# Altium schematic sheet ATT-Open.SchDoc
size 420 x 297 mm; SheetNumber: 1; SheetTotal: 1
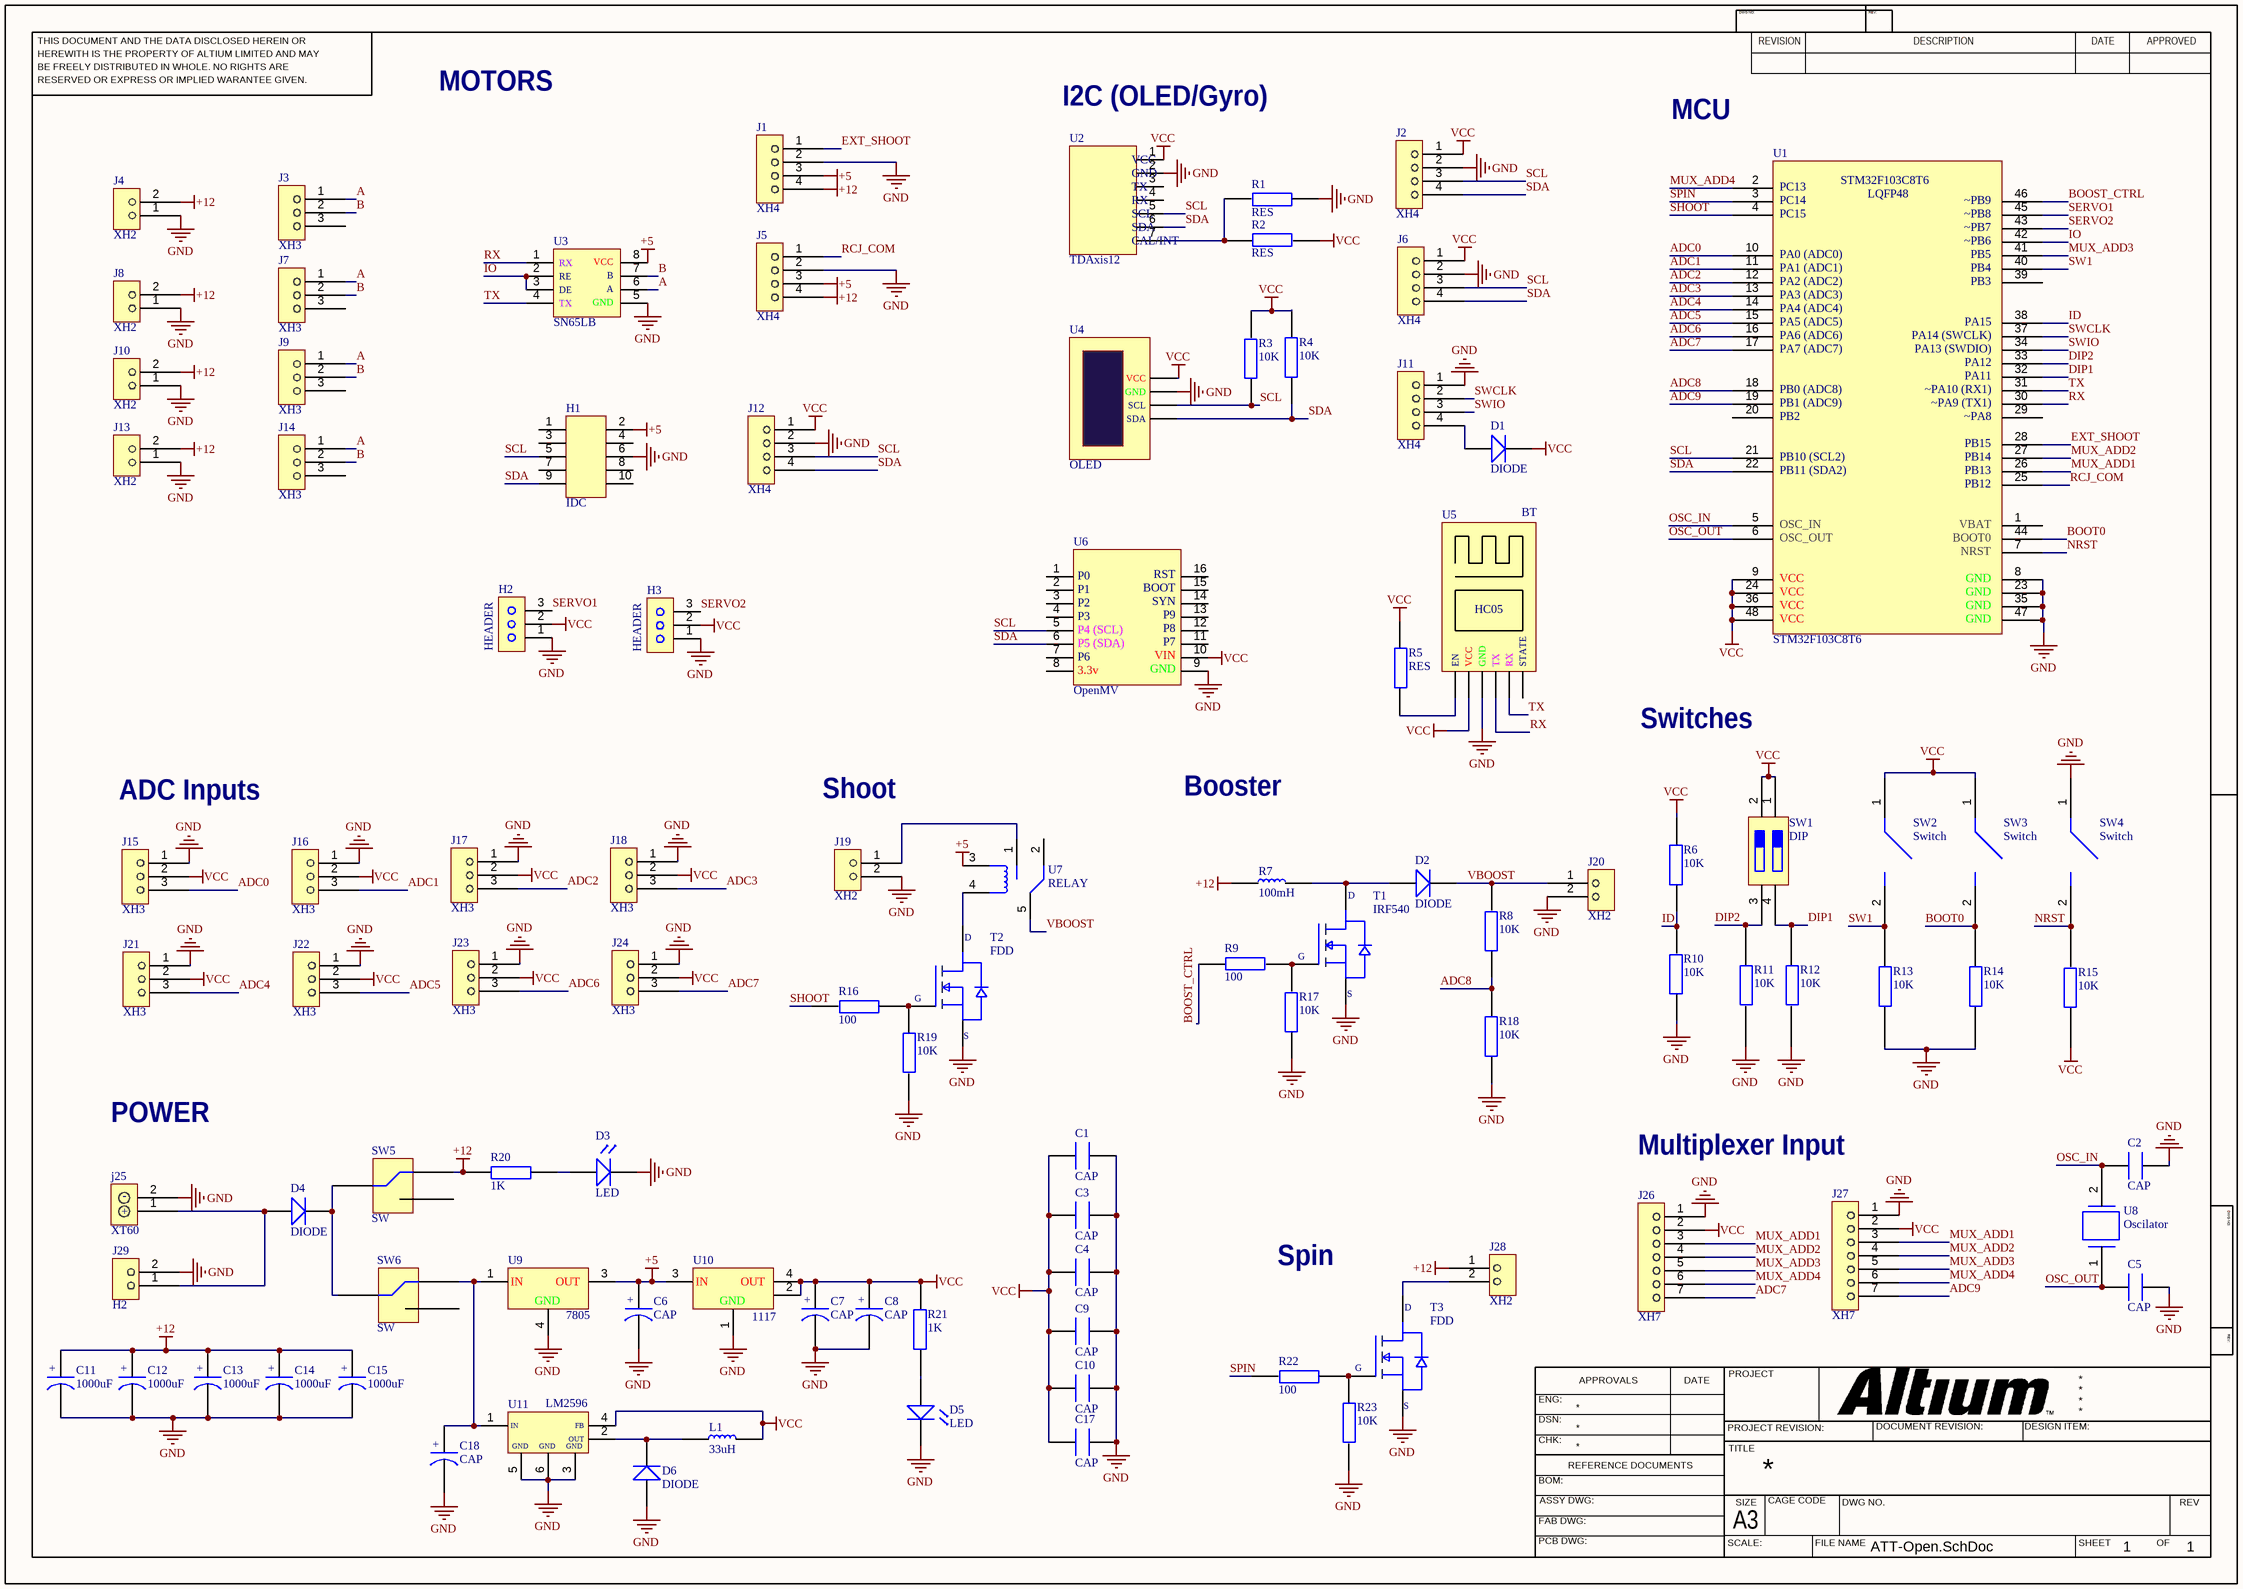
[diagram p0: ATT-Open.SchDoc]

## Parts
C1  CAP  [CAP1206]
C2  CAP  [CAP1206]
C3  CAP  [CAP1206]
C4  CAP  [CAP1206]
C5  CAP  [CAP1206]
C6  CAP  [CAP SMD 100uF 16V]
C7  CAP  [CAP SMD 100uF 16V]
C8  CAP  [CAP SMD 100uF 16V]
C9  CAP  [CAP1206]
C10  CAP  [CAP1206]
C11  1000uF  [CAP 5x10x13 black]
C12  1000uF  [CAP 5x10x13 black]
C13  1000uF  [CAP 5x10x13 black]
C14  1000uF  [CAP 5x10x13 black]
C15  1000uF  [CAP 5x10x13 black]
C17  CAP  [CAP1206]
C18  CAP  [CAP SMD 100uF 16V]
D1  DIODE  [Diode]
D2  DIODE  [Diode]
D3  LED  [LED GREEN 1206]
D4  DIODE  [Diode]
D5  LED  [LED GREEN 1206]
D6  DIODE  [Diode]
H1  IDC  [IDC 5x2]
H2  HEADER  [header 3 pin]
H3  HEADER  [header 3 pin]
J1  XH4  [XH 4PIN]
J2  XH4  [XH 4PIN]
J3  XH3  [XH 3PIN]
J4  XH2  [XH 2pin]
J5  XH4  [XH 4PIN]
J6  XH4  [XH 4PIN]
J7  XH3  [XH 3PIN]
J8  XH2  [XH 2pin]
J9  XH3  [XH 3PIN]
J10  XH2  [XH 2pin]
J11  XH4  [XH 4PIN]
J12  XH4  [XH 4PIN]
J13  XH2  [XH 2pin]
J14  XH3  [XH 3PIN]
J15  XH3  [XH 3PIN]
J16  XH3  [XH 3PIN]
J17  XH3  [XH 3PIN]
J18  XH3  [XH 3PIN]
J19  XH2  [XH 2pin]
J20  XH2  [XH 2pin]
J21  XH3  [XH 3PIN]
J22  XH3  [XH 3PIN]
J23  XH3  [XH 3PIN]
J24  XH3  [XH 3PIN]
j25  XT60  [XT60]
J26  XH7  [XH 7PIN]
J27  XH7  [XH 7PIN]
J28  XH2  [XH 2pin]
J29  H2  [H2 MOLEX]
L1  33uH  [Inductor 1206]
R1  RES  [RES1206]
R2  RES  [RES1206]
R3  10K  [RES1206]
R4  10K  [RES1206]
R5  RES  [RES1206]
R6  10K  [RES1206]
R7  100mH  [inductor]
R8  10K  [RES1206]
R9  100  [RES1206]
R10  10K  [RES1206]
R11  10K  [RES1206]
R12  10K  [RES1206]
R13  10K  [RES1206]
R14  10K  [RES1206]
R15  10K  [RES1206]
R16  100  [RES1206]
R17  10K  [RES1206]
R18  10K  [RES1206]
R19  10K  [RES1206]
R20  1K  [RES1206]
R21  1K  [RES1206]
R22  100  [RES1206]
R23  10K  [RES1206]
SW1  DIP  [DIP Switch 2]
SW2  Switch  [pushbutton]
SW3  Switch  [pushbutton]
SW4  Switch  [pushbutton]
SW5  SW  [SPDT Switch]
SW6  SW  [SPDT Switch]
T1  IRF540  [IRF540S]
T2  FDD  [FDD6690A]
T3  FDD  [FDD6690A]
U1  STM32F103C8T6  [STM32F103C8T6]
U2  TDAxis12  [TDAxis12]
U3  SN65LB  [SN65LB]
U4  OLED  [OLED SH1106]
U5  BT  [HC05]
U6  OpenMV  [OpenMV]
U7  RELAY  [Relay 5V 10A]
U8  Oscilator  [Crystal Oscilator]
U9  7805  [7805 (SOT-252)]
U10  1117  [AMS1117]
U11  LM2596  [LM2596]

## Nets
+5: C6.2 H1.2 J1.3 J5.3 U3.8 U7.3 U9.3 U10.3
+12: C11.2 C12.2 C13.2 C14.2 C15.2 J1.4 J4.2 J5.4 J8.2 J10.2 J13.2 J28.1 R7.1 R20.2 SW5.1
GND: C1.1 C2.2 C3.1 C4.1 C5.2 C6.1 C7.1 C8.1 C9.1 C10.1 C11.1 C12.1 C13.1 C14.1 C15.1 C17.1 C18.1 D3.2 D5.2 D6.1 H1.6 H2.1 H3.1 J1.2 J2.2 J4.1 J5.2 J6.2 J8.1 J10.1 J11.1 J12.2 J13.1 J15.1 J16.1 J17.1 J18.1 J19.2 J20.2 J21.1 J22.1 J23.1 J24.1 j25.2 J26.1 J27.1 J29.2 R1.1 R10.1 R11.2 R12.2 R13.2 R14.2 R17.1 R18.1 R19.2 R23.2 SW4.1 T1.3 T2.3 T3.3 U1.8 U1.23 U1.35 U1.47 U2.2 U3.5 U4.2 U5.3 U6.9 U9.4 U10.1 U11.3 U11.5 U11.6
VCC: C1.2 C3.2 C4.2 C7.2 C8.2 C9.2 C10.2 C17.2 D1.2 H2.2 H3.2 J2.1 J6.1 J12.1 J15.2 J16.2 J17.2 J18.2 J21.2 J22.2 J23.2 J24.2 J26.2 J27.2 L1.2 R2.2 R3.2 R4.2 R5.1 R6.2 R15.1 R21.2 SW1.1 SW1.2 SW2.1 SW3.1 U1.9 U1.24 U1.36 U1.48 U2.1 U4.1 U5.2 U6.10 U10.2 U10.4 U11.4
A: J3.1 J7.1 J9.1 J14.1 U3.6
ADC0: J15.3 U1.10
ADC1: J16.3 U1.11
ADC2: J17.3 U1.12
ADC3: J18.3 U1.13
ADC4: J21.3 U1.14
ADC5: J22.3 U1.15
ADC6: J23.3 U1.16
ADC7: J24.3 J26.7 U1.17
ADC8: R8.1 R18.2 U1.18
ADC9: J27.7 U1.19
B: J3.2 J7.2 J9.2 J14.2 U3.7
BOOST_CTRL: R9.1 U1.46
BOOT0: R14.1 SW3.2 U1.44
DIP1: R12.1 SW1.4 U1.32
DIP2: R11.1 SW1.3 U1.33
EXT_SHOOT: J1.1 U1.28
ID: R6.1 R10.2 U1.38
IO: U1.42 U3.2 U3.3
MUX_ADD1: J26.3 J27.3 U1.26
MUX_ADD2: J26.4 J27.4 U1.27
MUX_ADD3: J26.5 J27.5 U1.41
MUX_ADD4: J26.6 J27.6 U1.2
NRST: R15.2 SW4.2 U1.7
OSC_IN: C2.1 U1.5 U8.2
OSC_OUT: C5.1 U1.6 U8.1
RCJ_COM: J5.1 U1.25
RX: U1.30 U3.1 U5.4
SCL: H1.5 J2.3 J6.3 J12.3 R3.1 U1.21 U2.5 U4.3 U6.5
SDA: H1.9 J2.4 J6.4 J12.4 R4.1 U1.22 U2.6 U4.4 U6.6
SERVO1: H2.3 U1.45
SERVO2: H3.3 U1.43
SHOOT: R16.2 U1.4
SPIN: R22.2 U1.3
SW1: R13.1 SW2.2 U1.40
SWCLK: J11.2 U1.37
SWIO: J11.3 U1.34
TX: U1.31 U3.4 U5.5
VBOOST: D2.2 J20.1 R8.2 U7.5
NetC18_2: C18.2 SW6.1 U9.1 U11.1
NetD1_1: D1.1 J11.4
NetD2_1: D2.1 R7.2 T1.4
NetD3_1: D3.1 R20.1
NetD4_1: D4.1 j25.1 J29.1
NetD4_2: D4.2 SW5.2 SW6.2
NetD5_1: D5.1 R21.1
NetD6_2: D6.2 L1.1 U11.2
NetJ19_1: J19.1 U7.1
NetJ28_2: J28.2 T3.4
NetR1_2: R1.2 R2.1 U2.7
NetR5_2: R5.2 U5.1
NetR9_2: R9.2 R17.2 T1.1
NetR16_1: R16.1 R19.1 T2.1
NetR22_1: R22.1 R23.1 T3.1
NetT2_4: T2.4 U7.4

Not connected (* = marked no-connect by the designer): H1 1 3 4 7 8 10; J3 3; J7 3; J9 3; J14 3; SW5 3; SW6 3; U1 1 20 29 39; U2 3 4; U5 6; U6 1 2 3 4 7 8 11 12 13 14 15 16; U7 2

## Notes on the sheet
- MOTORS
- (near U2) I2C (OLED/Gyro)
- MCU
- Switches
- ADC Inputs
- Shoot
- Booster
- POWER
- Multiplexer Input
- Spin
- THIS DOCUMENT AND THE DATA DISCLOSED HEREIN OR
- HEREWITH IS THE PROPERTY OF ALTIUM LIMITED AND MAY
- DWG NO:
- REVISION
- REV:
- DESCRIPTION
- DATE
- APPROVED
- BE FREELY DISTRIBUTED IN WHOLE. NO RIGHTS ARE
- RESERVED OR EXPRESS OR IMPLIED WARANTEE GIVEN.
- ENG:
- APPROVALS
- PROJECT
- DSN:
- CHK:
- REFERENCE DOCUMENTS
- PROJECT REVISION:
- TITLE
- DOCUMENT REVISION:
- DESIGN ITEM:
- BOM:
- FAB DWG:
- PCB DWG:
- ASSY DWG:
- SCALE:
- A3
- SIZE
- CAGE CODE
- FILE NAME
- DWG NO.
- SHEET
- OF
- REV
- (in symbol 7805 (SOT-252)) IN; OUT; GND
- (in symbol AMS1117) IN; OUT; GND
- (in symbol CAP Electrolit SMD) +
- (in symbol Cap Electrolyte) +
- (in symbol FDD6690A) D; G; S
- (in symbol HC05) EN; VCC; GND; TX; RX; STATE
- (in symbol IRF540S) D; G; S
- (in symbol LM2596) IN; FB; OUT; GND
- (in symbol OLED SH1106) VCC; GND; SCL; SDA
- (in symbol OpenMV) RST; P0; BOOT; P1; SYN; P2; P9; P3; P8; P4 (SCL); P7; P5 (SDA); VIN; P6; GND; 3.3v
- (in symbol SN65LB) RX; VCC; RE; B; DE; A; TX; GND
- (in symbol STM32F103C8T6) PC13; LQFP48; ~PB9; PC14; ~PB8; PC15; ~PB7; ~PB6; PB5; PA0 (ADC0); PB4; PA1 (ADC1); PB3; PA2 (ADC2); PA3 (ADC3); PA4 (ADC4); PA15; PA5 (ADC5); PA14 (SWCLK); PA6 (ADC6); PA13 (SWDIO); PA7 (ADC7); PA12; PA11; ~PA10 (RX1); PB0 (ADC8); ~PA9 (TX1); PB1 (ADC9); ~PA8; PB2; PB15; PB14; PB10 (SCL2); PB13; PB11 (SDA2); PB12; VBAT; OSC_IN; BOOT0; OSC_OUT; NRST; GND; VCC
- (in symbol TDAxis12) VCC; GND; TX; RX; SCL; SDA; CAL/INT
- (in symbol XT60) -; +

## Library data of the parts
C1-C5 C9 C10 C17 = CAP1206: Capacitor SMD 1206
C6-C8 C18 = CAP Electrolit SMD: Capacitor Electrolit SMD
C11-C15 = Cap Electrolyte: CAP DIP
D3 D5 = LED SMD 1206
H1 = IDC BOX 5x2
H2 H3 = Header 3 pin
J1 J2 J5 J6 J11 J12 = XH 4PIN: XH Connector 4pins
J3 J7 J9 J14-J18 J21-J24 = XH 3PIN: XH Connector 3pins
J4 J8 J10 J13 J19 J20 J28 = XH 2PIN: XH Connector 2pins
j25 = XT60: XT60 Power Connector
J26 J27 = XH 7Pin: XH Connector 7pins
J29 = H2 MOLEX: molex connector
L1 = Inductor 1206
R1-R6 R8-R23 = RES1206: RESISTOR SMD
R7 = inductor: SELF INDUCTOR
SW1 = DIP SW 2: DIP Switch 2 pin
SW2-SW4 = pushbutton: Switch SMD Tact
SW5 SW6 = SPDT Switch: SPDT Power Switch
T1 = IRF540S: IRF-540 MOSFET N-Chanel
T2 T3 = FDD6690A: FDD6690A MOSFET N-Chanel
U1 = STM32F103C8T6: STM32F103C8T6 / LQFP48
U2 = TDAxis12: Gyroscpoe Sensor
U3 = SN65LB: BL DC MOTOR DRIVER
U4 = OLED SH1106: OLED SH1106 1.3inch
U5 = HC05: Bluetooth HC05 Module
U6 = OpenMV: OpenMV Camera H7 R2
U7 = Relay 5V 10A
U8 = Crystal: Crystal Oscilator 8MHz
U9 = 7805 (SOT-252): 5v Regulator
U10 = AMS1117: 3.3v Regulator
U11 = LM2596: 3.3v Regulator (Switching)